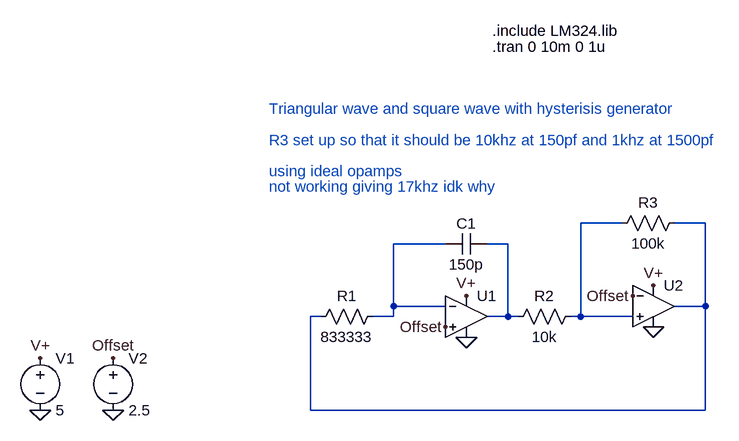
[diagram p0: schematic lab for transmitter.asc]
lab for transmitter.asc, the LTspice schematic file:
Version 4.1
SHEET 1 1452 680
WIRE 416 0 352 0
WIRE 544 0 496 0
WIRE 144 32 64 32
WIRE 240 32 208 32
WIRE 64 128 64 32
WIRE 144 128 64 128
WIRE 544 128 544 0
WIRE 544 128 496 128
WIRE -48 144 -64 144
WIRE 64 144 64 128
WIRE 64 144 32 144
WIRE 240 144 240 32
WIRE 240 144 208 144
WIRE 256 144 240 144
WIRE 352 144 352 0
WIRE 352 144 336 144
WIRE 432 144 352 144
WIRE -64 288 -64 144
WIRE 544 288 544 128
WIRE 544 288 -64 288
FLAG 176 176 0
FLAG 464 160 0
FLAG -480 208 V+
FLAG 176 112 V+
FLAG 464 96 V+
FLAG -480 288 0
FLAG 432 112 Offset
FLAG 144 160 Offset
FLAG -368 208 Offset
FLAG -368 288 0
SYMBOL OpAmps\\UniversalOpAmp2 176 144 R0
SYMATTR InstName U1
SYMBOL OpAmps\\UniversalOpAmp2 464 128 R0
SYMATTR InstName U2
SYMBOL res 352 128 R90
WINDOW 0 0 56 VBottom 2
WINDOW 3 32 56 VTop 2
SYMATTR InstName R2
SYMATTR Value 10k
SYMBOL res 512 -16 R90
WINDOW 0 0 56 VBottom 2
WINDOW 3 32 56 VTop 2
SYMATTR InstName R3
SYMATTR Value 100k
SYMBOL res 48 128 R90
WINDOW 0 0 56 VBottom 2
WINDOW 3 32 56 VTop 2
SYMATTR InstName R1
SYMATTR Value 833333
SYMBOL cap 208 16 R90
WINDOW 0 0 32 VBottom 2
WINDOW 3 32 32 VTop 2
SYMATTR InstName C1
SYMATTR Value 150p
SYMBOL voltage -480 192 R0
WINDOW 123 0 0 Left 0
WINDOW 39 0 0 Left 0
SYMATTR InstName V1
SYMATTR Value 5
SYMBOL voltage -368 192 R0
WINDOW 123 0 0 Left 0
WINDOW 39 0 0 Left 0
SYMATTR InstName V2
SYMATTR Value 2.5
TEXT 216 -296 Left 2 !.include LM324.lib
TEXT 216 -272 Left 2 !.tran 0 10m 0 1u
TEXT -128 -176 Left 2 ;Triangular wave and square wave with hysterisis generator
TEXT -128 -128 Left 2 ;R3 set up so that it should be 10khz at 150pf and 1khz at 1500pf
TEXT -128 -80 Left 2 ;using ideal opamps
TEXT -128 -56 Left 2 ;not working giving 17khz idk why

The netlist it stands for:
* lab for transmitter.asc
X§U1 Offset N003 V+ 0 N004 level2 Avol=1Meg GBW=10Meg Slew=10Meg Ilimit=25m Rail=0 Vos=0 En=0 Enk=0 In=0 Ink=0 Rin=500Meg  ; pins In+ In- V+ V- OUT
X§U2 N001 Offset V+ 0 N002 level2 Avol=1Meg GBW=10Meg Slew=10Meg Ilimit=25m Rail=0 Vos=0 En=0 Enk=0 In=0 Ink=0 Rin=500Meg  ; pins In+ In- V+ V- OUT
R2 N001 N004 10k
R3 N002 N001 100k
R1 N003 N002 833333
C1 N004 N003 150p
V1 V+ 0 5
V2 Offset 0 2.5
.include LM324.lib
.tran 0 10m 0 1u
* Triangular wave and square wave with hysterisis generator
* R3 set up so that it should be 10khz at 150pf and 1khz at 1500pf
* using ideal opamps
* not working giving 17khz idk why
.lib UniversalOpAmp2.lib
.backanno
.end